# Altium project Beehive_monitoring.PrjPcb
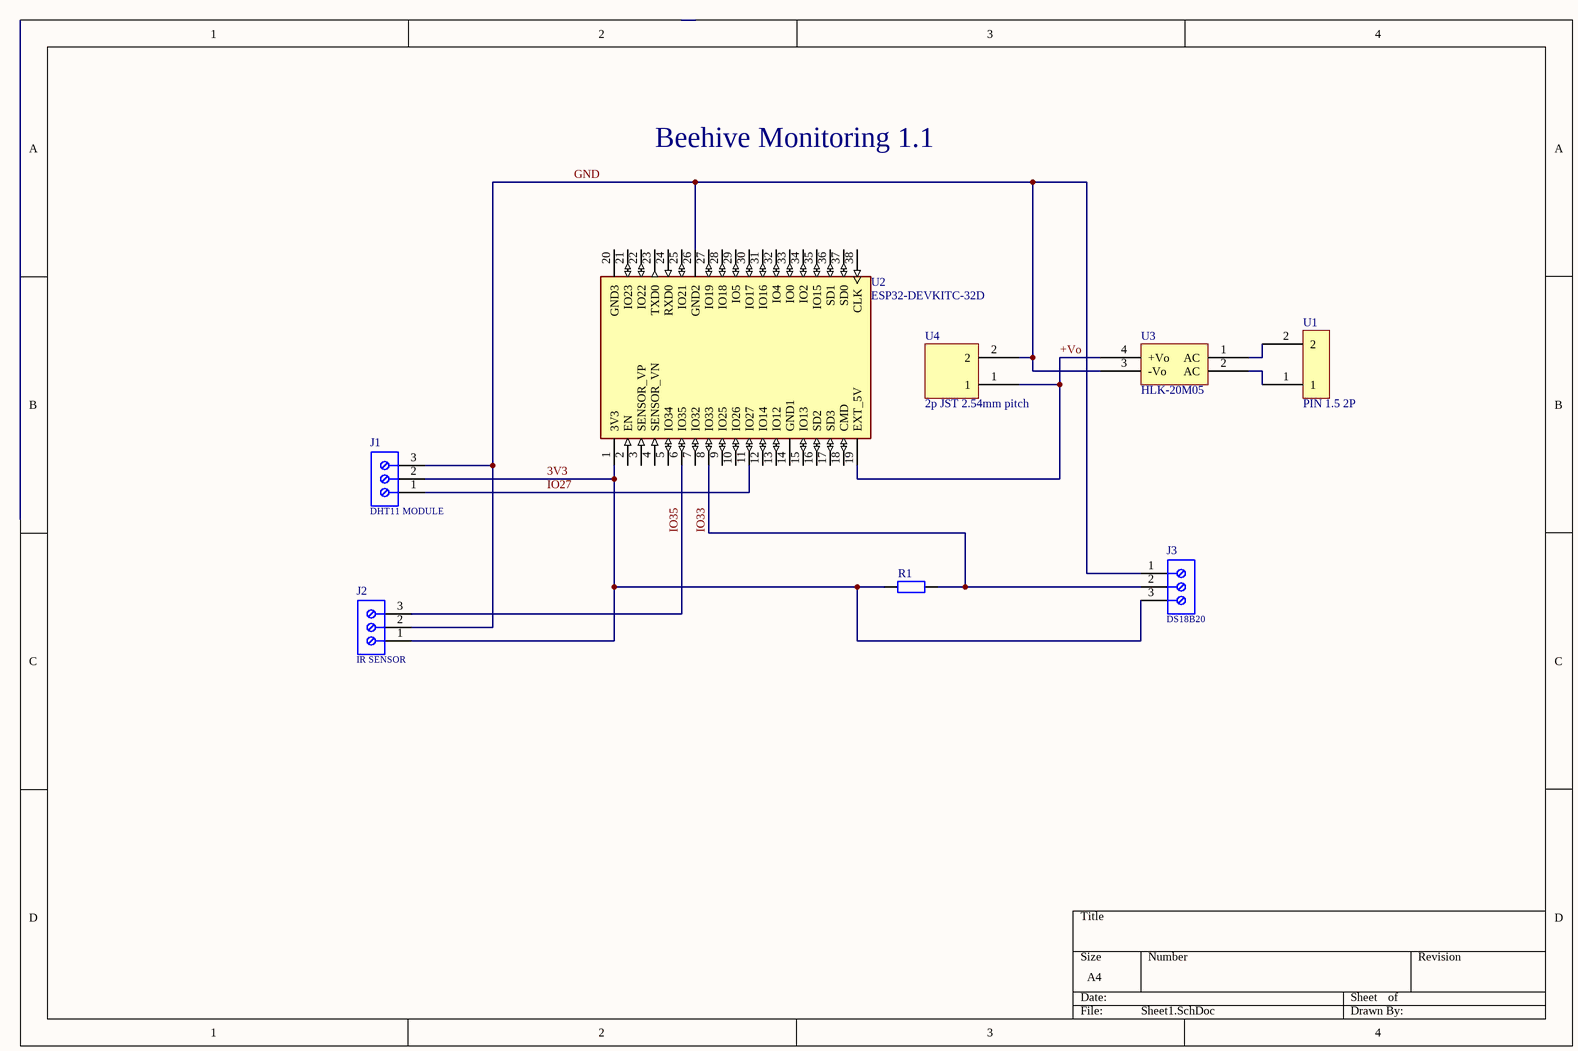
[diagram p0: Sheet1.SchDoc]
1 sheet, 8 parts. Net scope: global (net labels, ports and power ports of the same name join across sheets).
Board file: BEEHIVE.PcbDoc

## Sheet Sheet1.SchDoc
size A4; SheetNumber: 1; SheetTotal: 1

### Parts
J1  DHT11 MODULE  [691214110003]
J2  IR SENSOR  [691214110003]
J3  DS18B20  [691214110003]
R1  Res2  [AXIAL-0.4]  (value not drawn)
U1  PIN 1.5 2P  [PIN 1.5MM 2PIN]
U2  ESP32-DEVKITC-32D  [MODULE_ESP32-DEVKITC-32D]
U3  HLK-20M05  [HLK-20M05]
U4  2p JST 2.54mm pitch  [PCBComponent_1]

### Nets
3V3: J1.2 J2.1 J3.3 R1.1 U2.1(3V3)
+Vo: U2.19(EXT_5V) U3.4(+Vo) U4.1
GND: J1.3 J2.2 J3.1 U2.26(GND2) U3.3(-Vo) U4.2
IO27: J1.1 U2.11(IO27)
IO33: J3.2 R1.2 U2.8(IO33)
IO35: J2.3 U2.6(IO35)
NetU1_1: U1.1 U3.2(AC)
NetU1_2: U1.2 U3.1(AC)

Not connected (* = marked no-connect by the designer): U2 2(EN) 3(SENSOR_VP) 4(SENSOR_VN) 5(IO34) 7(IO32) 9(IO25) 10(IO26) 12(IO14) 13(IO12) 14(GND1) 15(IO13) 16(SD2) 17(SD3) 18(CMD) 20(GND3) 21(IO23) 22(IO22) 23(TXD0) 24(RXD0) 25(IO21) 27(IO19) 28(IO18) 29(IO5) 30(IO17) 31(IO16) 32(IO4) 33(IO0) 34(IO2) 35(IO15) 36(SD1) 37(SD0) 38(CLK)

### Notes on the sheet
- Beehive Monitoring 1.1

### Library data of the parts
J1-J3 = CMP-1502-02466-1: Serie 2141 - 3.50 mm Horizontal Entry Modular with Rising Cage Clamp WR-TBL, 3 pin; Manufacturer: Wurth Elektronik; Pin Number: 3; Pitch: 3.50mm; Package Reference: 691214110003; Mounting Technology: THT; Part Number: 691214110003; Manufacturer URL: http://www.we-online.de; Packaging: Box; Operating Temperature: -40to105degC; Publisher: WurthElektronik; Datasheet URL: http://katalog.we-online.de/em/datasheet/6912141100xx.pdf
R1 = Res2: Resistor; Value: 1K; Published: 8-Jun-2000; LatestRevisionDate: 17-Jul-2002; LatestRevisionNote: Re-released for DXP Platform.; PackageReference: AXIAL-0.4; Publisher: Altium Limited; PackageDescription: Axial Device, Thru-Hole; 2 Leads; 0.4 in Pin Spacing
U1 = PIN 1.5 2P: BORNERA 1.5MM 2.8MM 2P
U2 = ESP32-DEVKITC-32D: EVAL BOARD FOR ESP-WROOM-32; MF: Espressif Systems; Value: *; MP: ESP32-DEVKITC-32D; Price: None; Check_prices: https://www.snapeda.com/parts/ESP32-DEVKITC-32D/Espressif%20Systems/view-part/2777395/?ref=eda; SnapEDA_Link: https://www.snapeda.com/parts/ESP32-DEVKITC-32D/Espressif%20Systems/view-part/2777395/?ref=snap; Availability: Warning; Purchase-URL: https://pricing.snapeda.com/search/part/ESP32-DEVKITC-32D/?ref=eda; Package: None
U4 = Component_1